# EAGLE design SwirlsV1.2 (EAGLE 6.5.0)

## Sheet 1 of 3
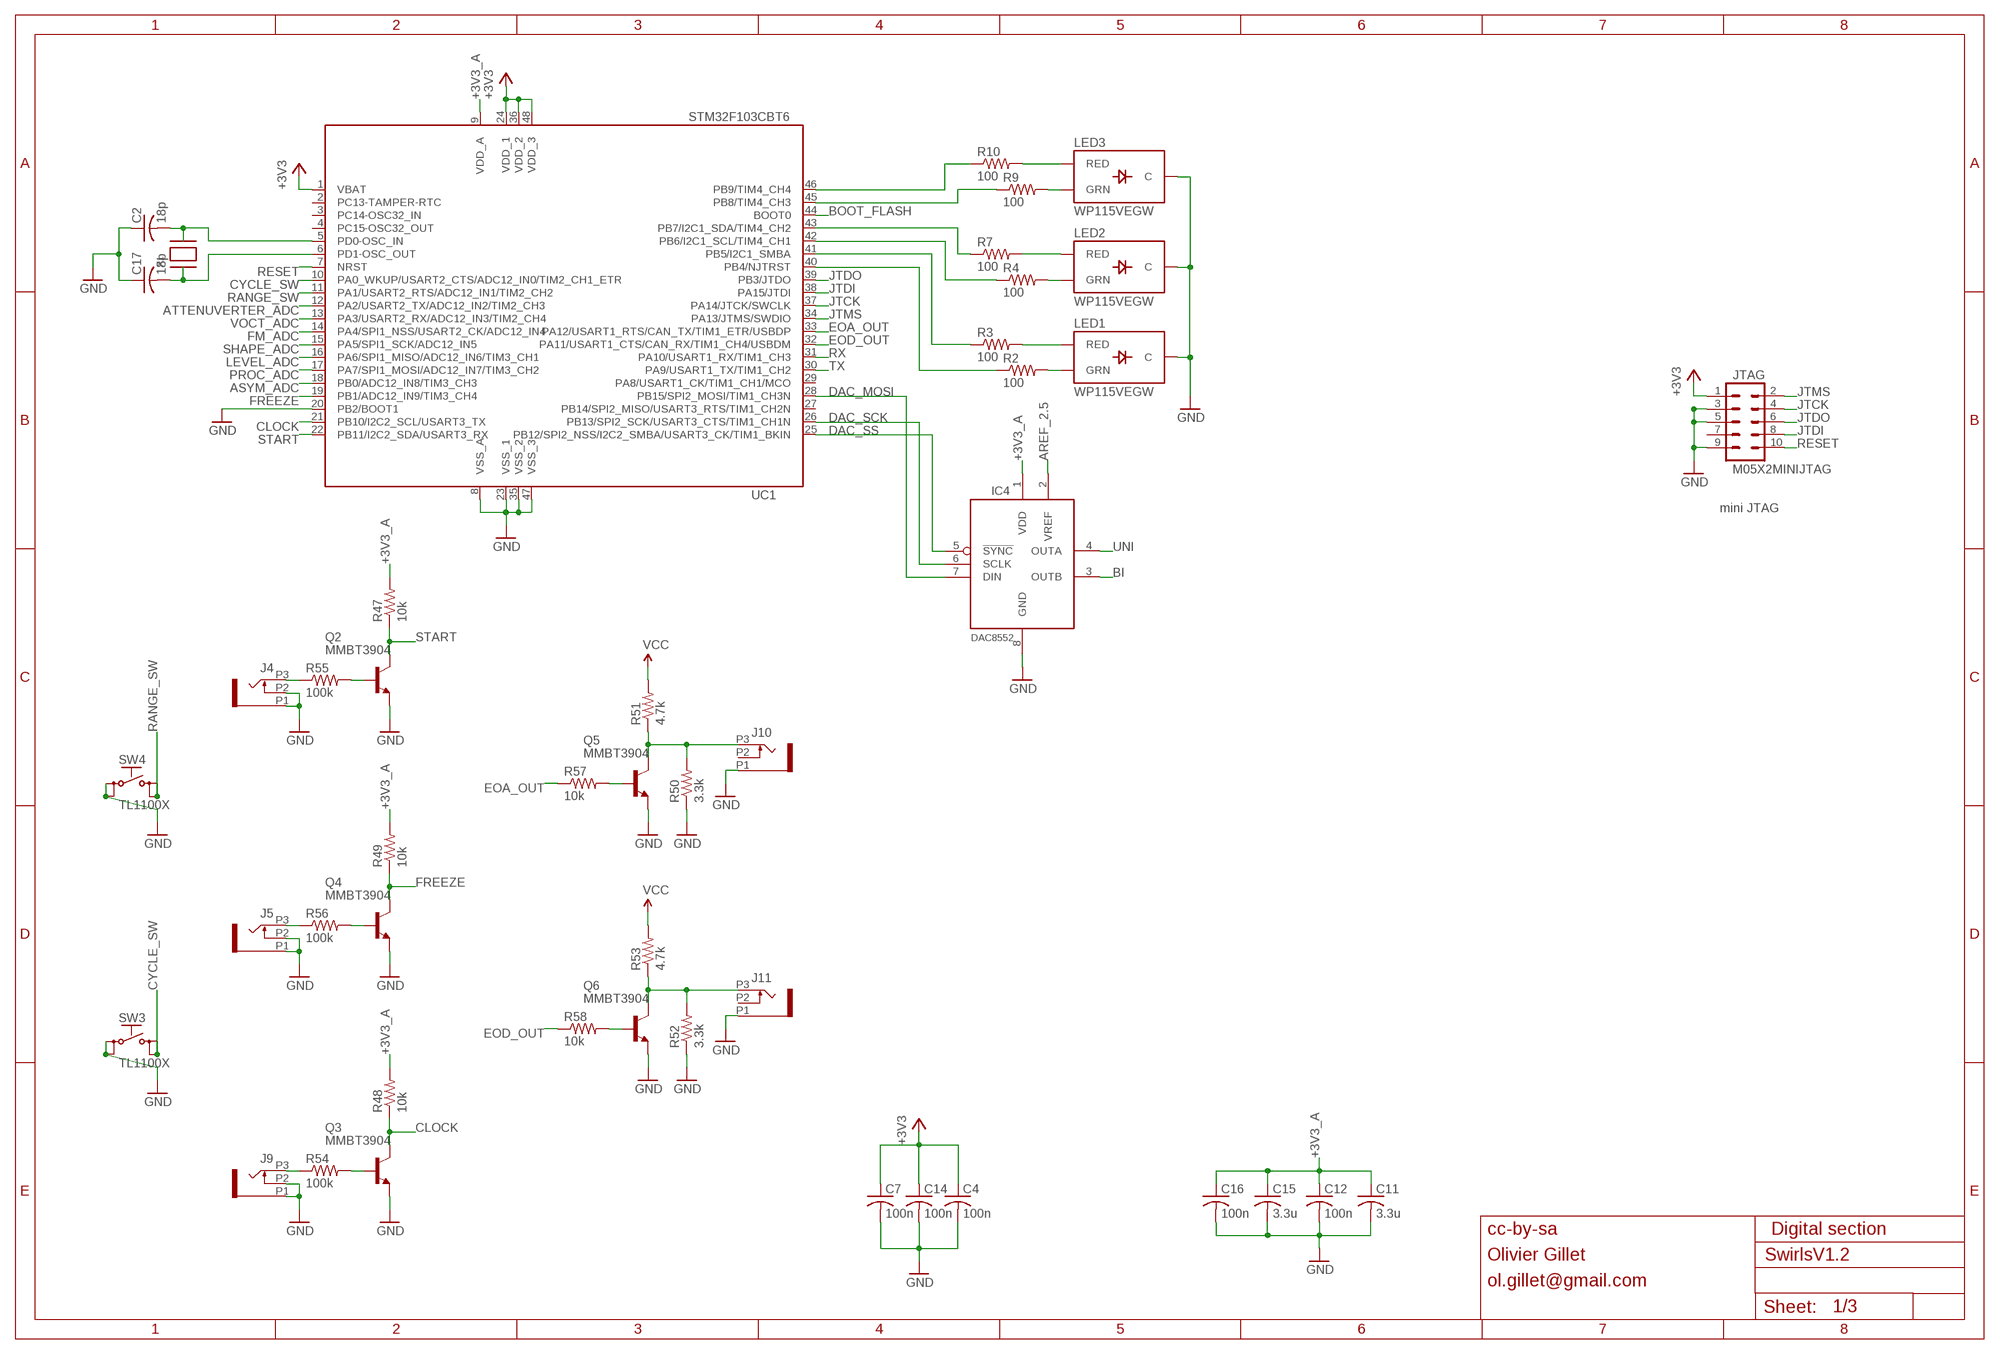
[diagram p0: schematic, sheet 1]

### Parts
C2  18p  C-USC0603  [C0603]
C4  100n  C-USC0603  [C0603]
C7  100n  C-USC0603  [C0603]
C11  3.3u  C-USC0603  [C0603]
C12  100n  C-USC0603  [C0603]
C14  100n  C-USC0603  [C0603]
C15  3.3u  C-USC0603  [C0603]
C16  100n  C-USC0603  [C0603]
C17  18p  C-USC0603  [C0603]
IC4  DAC8552  [MSOP-8]
J4  PJ301_GUI6  [OG-PJ301_VARIATIONS_WQP_PJ_301M6]
J5  PJ301_GUI6  [OG-PJ301_VARIATIONS_WQP_PJ_301M6]
J9  PJ301_GUI6  [OG-PJ301_VARIATIONS_WQP_PJ_301M6]
J10  PJ301_GUI6  [OG-PJ301_VARIATIONS_WQP_PJ_301M6]
J11  PJ301_GUI6  [OG-PJ301_VARIATIONS_WQP_PJ_301M6]
JTAG  M05X2MINIJTAG  [2X5-1.27]
LED1  WP115VEGW  LED-BICOLOR-THROUGHHOLE  [LED-BICOLOR-THROUGHHOLE]
LED2  WP115VEGW  LED-BICOLOR-THROUGHHOLE  [LED-BICOLOR-THROUGHHOLE]
LED3  WP115VEGW  LED-BICOLOR-THROUGHHOLE  [LED-BICOLOR-THROUGHHOLE]
Q2  MMBT3904  MMBT3904LT1-NPN-SOT23-BEC  [SOT23-BEC]
Q3  MMBT3904  MMBT3904LT1-NPN-SOT23-BEC  [SOT23-BEC]
Q4  MMBT3904  MMBT3904LT1-NPN-SOT23-BEC  [SOT23-BEC]
Q5  MMBT3904  MMBT3904LT1-NPN-SOT23-BEC  [SOT23-BEC]
Q6  MMBT3904  MMBT3904LT1-NPN-SOT23-BEC  [SOT23-BEC]
R2  100  R-US_R0603  [R0603]
R3  100  R-US_R0603  [R0603]
R4  100  R-US_R0603  [R0603]
R7  100  R-US_R0603  [R0603]
R9  100  R-US_R0603  [R0603]
R10  100  R-US_R0603  [R0603]
R47  10k  R-US_R0603  [R0603]
R48  10k  R-US_R0603  [R0603]
R49  10k  R-US_R0603  [R0603]
R50  3.3k  R-US_R0603  [R0603]
R51  4.7k  R-US_R0603  [R0603]
R52  3.3k  R-US_R0603  [R0603]
R53  4.7k  R-US_R0603  [R0603]
R54  100k  R-US_R0603  [R0603]
R55  100k  R-US_R0603  [R0603]
R56  100k  R-US_R0603  [R0603]
R57  10k  R-US_R0603  [R0603]
R58  10k  R-US_R0603  [R0603]
SW3  TL1100X  [TL1100X]
SW4  TL1100X  [TL1100X]
UC1  STM32F103CBT6  STM32F103CB  [LQFP48]
X1  XTALNX5032  [NX5032]

### Nets
+3V3: C4.1 C7.1 C14.1 JTAG.1 UC1.1(VBAT) UC1.24(VDD_1) UC1.36(VDD_2) UC1.48(VDD_3) ; also sheet 3
+3V3_A: C11.1 C12.1 C15.1 C16.1 IC4.1(VDD) R47.2 R48.2 R49.2 UC1.9(VDD_A) ; also sheet 2,3
AREF_2.5: IC4.2(VREF) ; also sheet 3
ASYM_ADC: UC1.18(PB0/ADC12_IN8/TIM3_CH3) ; also sheet 2
ATTENUVERTER_ADC: UC1.12(PA2/USART2_TX/ADC12_IN2/TIM2_CH3) ; also sheet 2
BI: IC4.3(OUTB) ; also sheet 2
BOOT_FLASH: UC1.44(BOOT0)
CLOCK: Q3.C R48.1 UC1.21(PB10/I2C2_SCL/USART3_TX)
CYCLE_SW: SW3.3(S) SW3.4(S1) UC1.10(PA0_WKUP/USART2_CTS/ADC12_IN0/TIM2_CH1_ETR)
DAC_MOSI: IC4.7(DIN) UC1.28(PB15/SPI2_MOSI/TIM1_CH3N)
DAC_SCK: IC4.6(SCLK) UC1.26(PB13/SPI2_SCK/USART3_CTS/TIM1_CH1N)
DAC_SS: IC4.5(!SYNC) UC1.25(PB12/SPI2_NSS/I2C2_SMBA/USART3_CK/TIM1_BKIN)
EOA_OUT: R57.1 UC1.33(PA12/USART1_RTS/CAN_TX/TIM1_ETR/USBDP)
EOD_OUT: R58.1 UC1.32(PA11/USART1_CTS/CAN_RX/TIM1_CH4/USBDM)
FM_ADC: UC1.14(PA4/SPI1_NSS/USART2_CK/ADC12_IN4) ; also sheet 2
FREEZE: Q4.C R49.1 UC1.19(PB1/ADC12_IN9/TIM3_CH4)
GND: C2.1 C4.2 C7.2 C11.2 C12.2 C14.2 C15.2 C16.2 C17.1 IC4.8(GND) J4.P1 J4.P2 J5.P1 J5.P2 J9.P1 J9.P2 J10.P1 J11.P1 JTAG.3 JTAG.5 JTAG.9 LED1.2(C) LED2.2(C) LED3.2(C) Q2.E Q3.E Q4.E Q5.E Q6.E R50.1 R52.1 SW3.1(P) SW3.2(P1) SW4.1(P) SW4.2(P1) UC1.8(VSS_A) UC1.20(PB2/BOOT1) UC1.23(VSS_1) UC1.35(VSS_2) UC1.47(VSS_3) ; also sheet 2,3
JTCK: JTAG.4 UC1.37(PA14/JTCK/SWCLK)
JTDI: JTAG.8 UC1.38(PA15/JTDI)
JTDO: JTAG.6 UC1.39(PB3/JTDO)
JTMS: JTAG.2 UC1.34(PA13/JTMS/SWDIO)
LEVEL_ADC: UC1.16(PA6/SPI1_MISO/ADC12_IN6/TIM3_CH1) ; also sheet 2
N$7: C2.2 UC1.5(PD0-OSC_IN) X1.P$2
N$8: C17.2 UC1.6(PD1-OSC_OUT) X1.P$1
N$21: J5.P3 R56.1
N$23: Q4.B R56.2
N$24: J9.P3 R54.1
N$25: Q3.B R54.2
N$26: Q6.B R58.2
N$27: J11.P3 Q6.C R52.2 R53.1
N$28: LED3.3(RED) R10.2
N$29: LED3.1(GRN) R9.2
N$30: LED2.3(RED) R7.2
N$31: LED2.1(GRN) R4.2
N$32: LED1.3(RED) R3.2
N$33: LED1.1(GRN) R2.2
N$34: R10.1 UC1.46(PB9/TIM4_CH4)
N$35: R9.1 UC1.45(PB8/TIM4_CH3)
N$36: R7.1 UC1.43(PB7/I2C1_SDA/TIM4_CH2)
N$37: R4.1 UC1.42(PB6/I2C1_SCL/TIM4_CH1)
N$38: R3.1 UC1.41(PB5/I2C1_SMBA)
N$39: R2.1 UC1.40(PB4/NJTRST)
N$44: J10.P3 Q5.C R50.2 R51.1
N$47: Q5.B R57.2
N$57: J4.P3 R55.1
N$66: Q2.B R55.2
PROC_ADC: UC1.17(PA7/SPI1_MOSI/ADC12_IN7/TIM3_CH2) ; also sheet 2
RANGE_SW: SW4.3(S) SW4.4(S1) UC1.11(PA1/USART2_RTS/ADC12_IN1/TIM2_CH2)
RESET: JTAG.10 UC1.7(NRST)
RX: UC1.31(PA10/USART1_RX/TIM1_CH3)
SHAPE_ADC: UC1.15(PA5/SPI1_SCK/ADC12_IN5) ; also sheet 2
START: Q2.C R47.1 UC1.22(PB11/I2C2_SDA/USART3_RX)
TX: UC1.30(PA9/USART1_TX/TIM1_CH2)
UNI: IC4.4(OUTA) ; also sheet 2
VCC: R51.2 R53.2 ; also sheet 2,3
VOCT_ADC: UC1.13(PA3/USART2_RX/ADC12_IN3/TIM2_CH4) ; also sheet 2
Unconnected: J10.P2 J11.P2 JTAG.7 UC1.2(PC13-TAMPER-RTC) UC1.3(PC14-OSC32_IN) UC1.4(PC15-OSC32_OUT) UC1.27(PB14/SPI2_MISO/USART3_RTS/TIM1_CH2N) UC1.29(PA8/USART1_CK/TIM1_CH1/MCO)

### Notes on the sheet
- mini JTAG
- cc-by-sa | Digital section
- Olivier Gillet
- ol.gillet@gmail.com

## Sheet 2 of 3
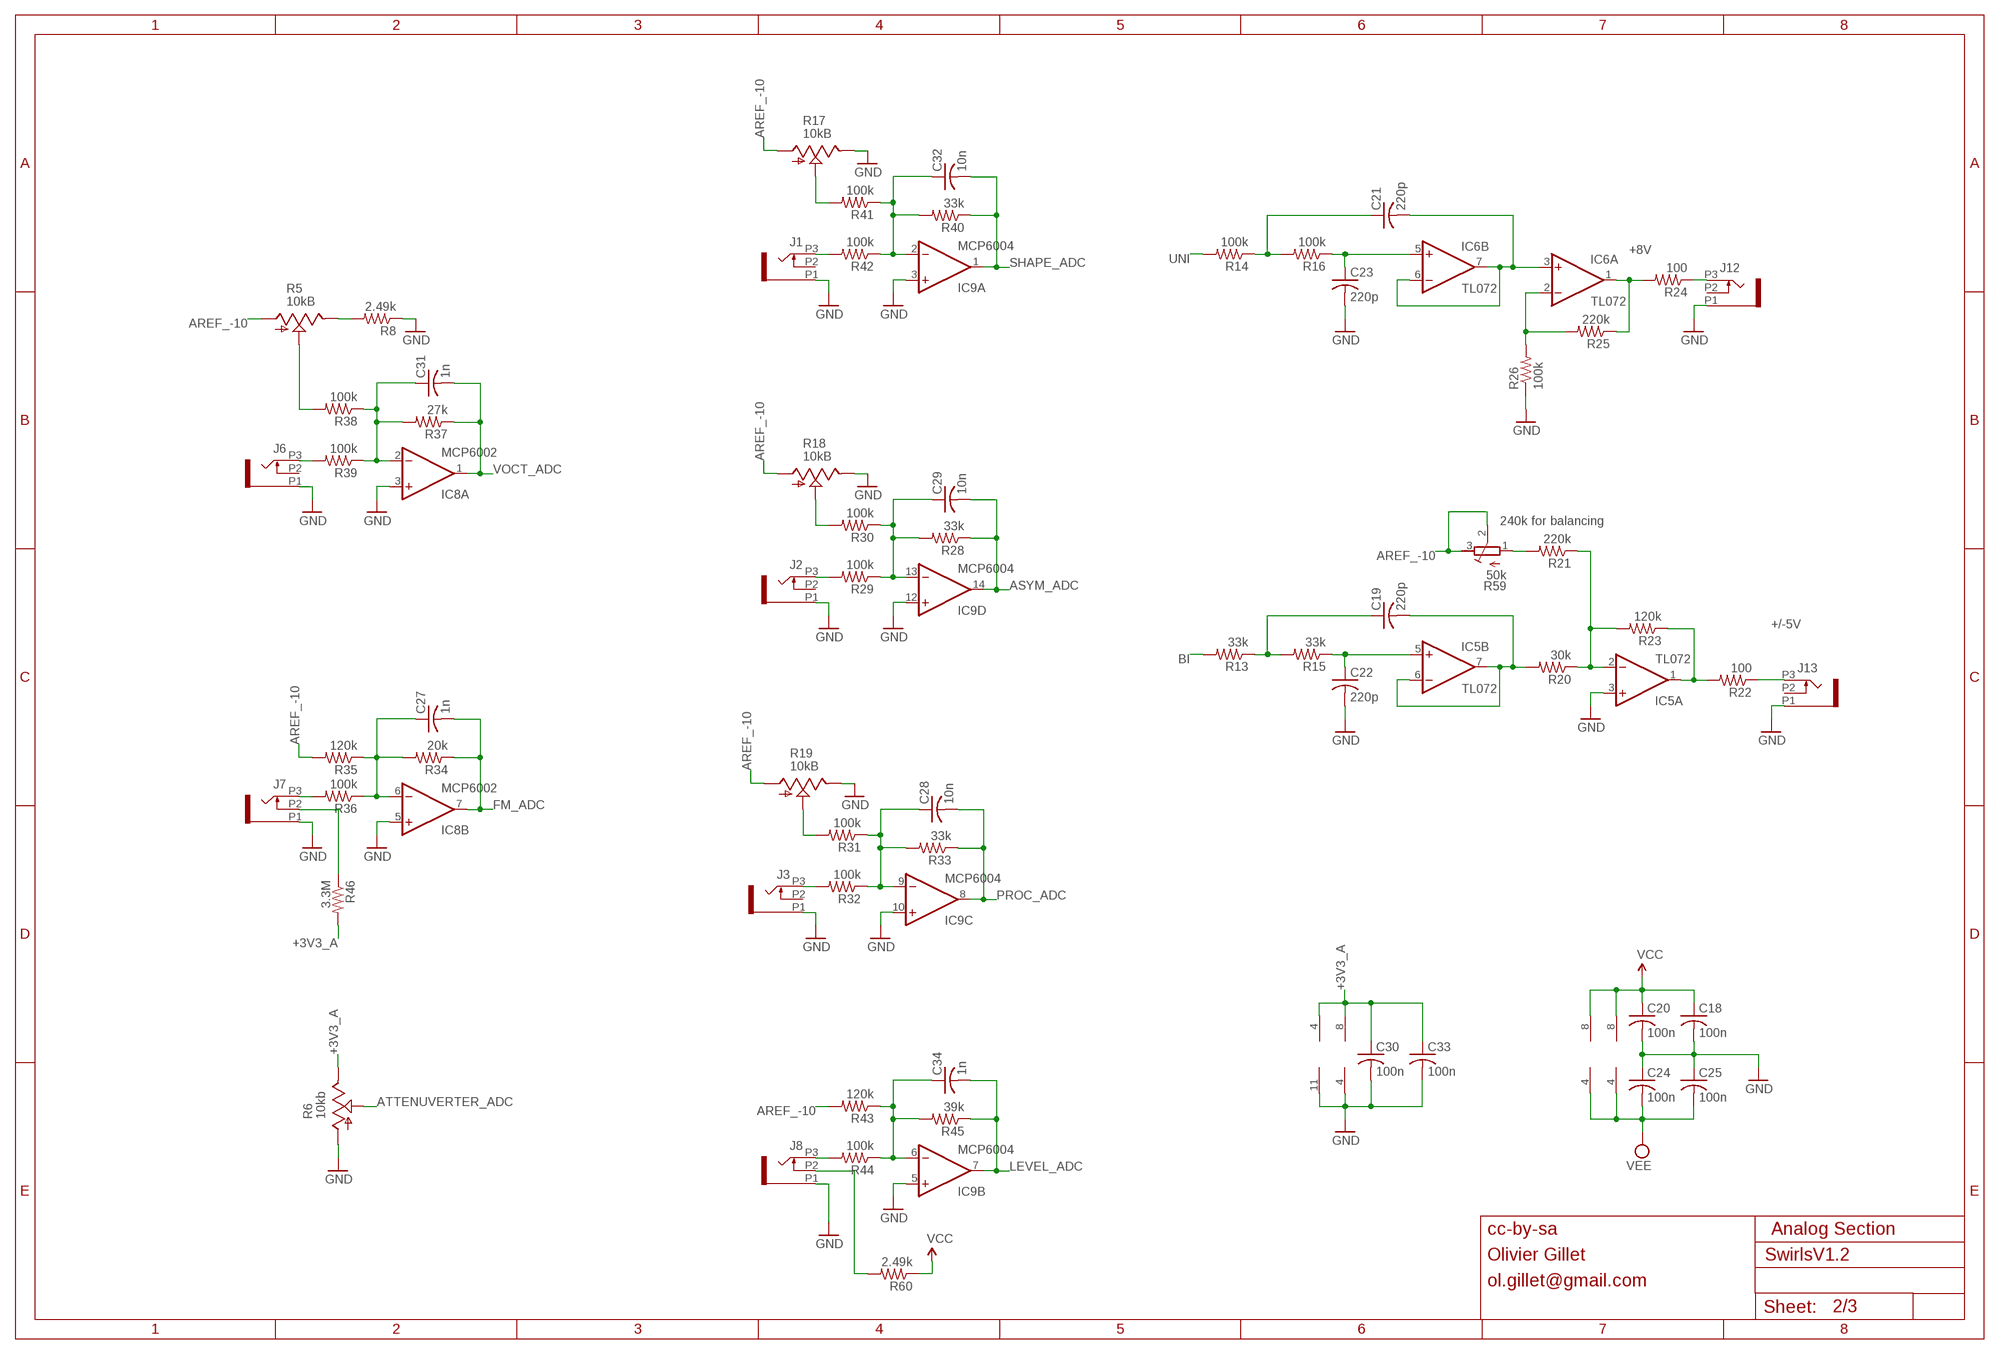
[diagram p1: schematic, sheet 2]

### Parts
C18  100n  C-USC0603  [C0603]
C19  220p  C-USC0603  [C0603]
C20  100n  C-USC0603  [C0603]
C21  220p  C-USC0603  [C0603]
C22  220p  C-USC0603  [C0603]
C23  220p  C-USC0603  [C0603]
C24  100n  C-USC0603  [C0603]
C25  100n  C-USC0603  [C0603]
C27  1n  C-USC0603  [C0603]
C28  10n  C-USC0603  [C0603]
C29  10n  C-USC0603  [C0603]
C30  100n  C-USC0603  [C0603]
C31  1n  C-USC0603  [C0603]
C32  10n  C-USC0603  [C0603]
C33  100n  C-USC0603  [C0603]
C34  1n  C-USC0603  [C0603]
IC5  TL072  TL072TSSOP  [TSSOP-8]
IC6  TL072  TL072TSSOP  [TSSOP-8]
IC8  MCP6002  TL072D  [SO08]
IC9  MCP6004  MCP6004ST  [TSSOP14]
J1  PJ301_GUI6  [OG-PJ301_VARIATIONS_WQP_PJ_301M6]
J2  PJ301_GUI6  [OG-PJ301_VARIATIONS_WQP_PJ_301M6]
J3  PJ301_GUI6  [OG-PJ301_VARIATIONS_WQP_PJ_301M6]
J6  PJ301_GUI6  [OG-PJ301_VARIATIONS_WQP_PJ_301M6]
J7  PJ301_GUI6  [OG-PJ301_VARIATIONS_WQP_PJ_301M6]
J8  PJ301_GUI6  [OG-PJ301_VARIATIONS_WQP_PJ_301M6]
J12  PJ301_GUI6  [OG-PJ301_VARIATIONS_WQP_PJ_301M6]
J13  PJ301_GUI6  [OG-PJ301_VARIATIONS_WQP_PJ_301M6]
R5  10kB  POT_USVERTICAL_PS  [ALPS_POT_VERTICAL_PS]
R6  10kb  POT-ALPS_POT_US  [TALLTRIMMER]
R8  2.49k  R-US_R0603  [R0603]
R13  33k  R-US_R0603  [R0603]
R14  100k  R-US_R0603  [R0603]
R15  33k  R-US_R0603  [R0603]
R16  100k  R-US_R0603  [R0603]
R17  10kB  POT-ALPS_POT_US  [TALLTRIMMER]
R18  10kB  POT-ALPS_POT_US  [TALLTRIMMER]
R19  10kB  POT-ALPS_POT_US  [TALLTRIMMER]
R20  30k  R-US_R0603  [R0603]
R21  220k  R-US_R0603  [R0603]
R22  100  R-US_R0603  [R0603]
R23  120k  R-US_R0603  [R0603]
R24  100  R-US_R0603  [R0603]
R25  220k  R-US_R0603  [R0603]
R26  100k  R-US_R0603  [R0603]
R28  33k  R-US_R0603  [R0603]
R29  100k  R-US_R0603  [R0603]
R30  100k  R-US_R0603  [R0603]
R31  100k  R-US_R0603  [R0603]
R32  100k  R-US_R0603  [R0603]
R33  33k  R-US_R0603  [R0603]
R34  20k  R-US_R0603  [R0603]
R35  120k  R-US_R0603  [R0603]
R36  100k  R-US_R0603  [R0603]
R37  27k  R-US_R0603  [R0603]
R38  100k  R-US_R0603  [R0603]
R39  100k  R-US_R0603  [R0603]
R40  33k  R-US_R0603  [R0603]
R41  100k  R-US_R0603  [R0603]
R42  100k  R-US_R0603  [R0603]
R43  120k  R-US_R0603  [R0603]
R44  100k  R-US_R0603  [R0603]
R45  39k  R-US_R0603  [R0603]
R46  3.3M  R-US_R0603  [R0603]
R59  50k  R-TRIMM3296W  [RTRIM3296W]
R60  2.49k  R-US_R0805  [R0805]

### Nets
+3V3_A: C30.1 C33.1 IC8.8(P:V+) IC9.4(P:V+) R6.P$1(E) R46.2 ; also sheet 1,3
AREF_-10: R5.P$3(A) R17.P$3(A) R18.P$3(A) R19.P$3(A) R35.2 R43.2 R59.2(S) R59.3(E) ; also sheet 3
ASYM_ADC: C29.2 IC9.14(D:OUT) R28.1 ; also sheet 1
ATTENUVERTER_ADC: R6.P$2(S) ; also sheet 1
BI: R13.2 ; also sheet 1
BI_OUT: IC5.1(A:OUT) R22.2 R23.1
F_CV: IC5.2(A:-IN) R20.1 R21.1 R23.2
FM_ADC: C27.2 IC8.7(B:OUT) R34.1 ; also sheet 1
GND: C18.2 C20.2 C22.2 C23.2 C24.1 C25.1 C30.2 C33.2 IC5.3(A:+IN) IC8.3(A:+IN) IC8.4(P:V-) IC8.5(B:+IN) IC9.3(A:+IN) IC9.5(B:+IN) IC9.10(C:+IN) IC9.11(P:V-) IC9.12(D:+IN) J1.P1 J2.P1 J3.P1 J6.P1 J7.P1 J8.P1 J12.P1 J13.P1 R6.P$3(A) R8.1 R17.P$1(E) R18.P$1(E) R19.P$1(E) R26.1 ; also sheet 1,3
LEVEL_ADC: C34.2 IC9.7(B:OUT) R45.1 ; also sheet 1
N$1: J1.P3 R42.2
N$2: C32.1 IC9.2(A:-IN) R40.2 R41.1 R42.1
N$3: R17.P$2(S) R41.2
N$4: J2.P3 R29.2
N$5: C29.1 IC9.13(D:-IN) R28.2 R29.1 R30.1
N$6: J7.P2 R46.1
N$9: R18.P$2(S) R30.2
N$10: J3.P3 R32.2
N$11: C28.1 IC9.9(C:-IN) R31.1 R32.1 R33.2
N$12: R19.P$2(S) R31.2
N$13: J8.P3 R44.2
N$14: C34.1 IC9.6(B:-IN) R43.1 R44.1 R45.2
N$15: J6.P3 R39.2
N$16: C31.1 IC8.2(A:-IN) R37.2 R38.1 R39.1
N$17: R5.P$2(S) R38.2
N$18: J13.P3 R22.1
N$19: R5.P$1(E) R8.2
N$20: J7.P3 R36.2
N$22: C27.1 IC8.6(B:-IN) R34.2 R35.1 R36.1
N$40: R21.2 R59.1(A)
N$41: IC6.2(A:-IN) R25.2 R26.2
N$42: C19.2 IC5.6(B:-IN) IC5.7(B:OUT) R20.2
N$43: C22.1 IC5.5(B:+IN) R15.1
N$45: C19.1 R13.1 R15.2
N$46: IC6.1(A:OUT) R24.2 R25.1
N$48: J8.P2 R60.2
N$67: C21.2 IC6.3(A:+IN) IC6.6(B:-IN) IC6.7(B:OUT)
N$69: C23.1 IC6.5(B:+IN) R16.1
N$71: C21.1 R14.1 R16.2
PROC_ADC: C28.2 IC9.8(C:OUT) R33.1 ; also sheet 1
SHAPE_ADC: C32.2 IC9.1(A:OUT) R40.1 ; also sheet 1
UNI: R14.2 ; also sheet 1
UNI_OUT: J12.P3 R24.1
VCC: C18.1 C20.1 IC5.8(P:V+) IC6.8(P:V+) R60.1 ; also sheet 1,3
VEE: C24.2 C25.2 IC5.4(P:V-) IC6.4(P:V-) ; also sheet 3
VOCT_ADC: C31.2 IC8.1(A:OUT) R37.1 ; also sheet 1
Unconnected: J1.P2 J2.P2 J3.P2 J6.P2 J12.P2 J13.P2

### Notes on the sheet
- +8V
- 240k for balancing
- +/-5V
- cc-by-sa | Analog Section
- Olivier Gillet
- ol.gillet@gmail.com

## Sheet 3 of 3
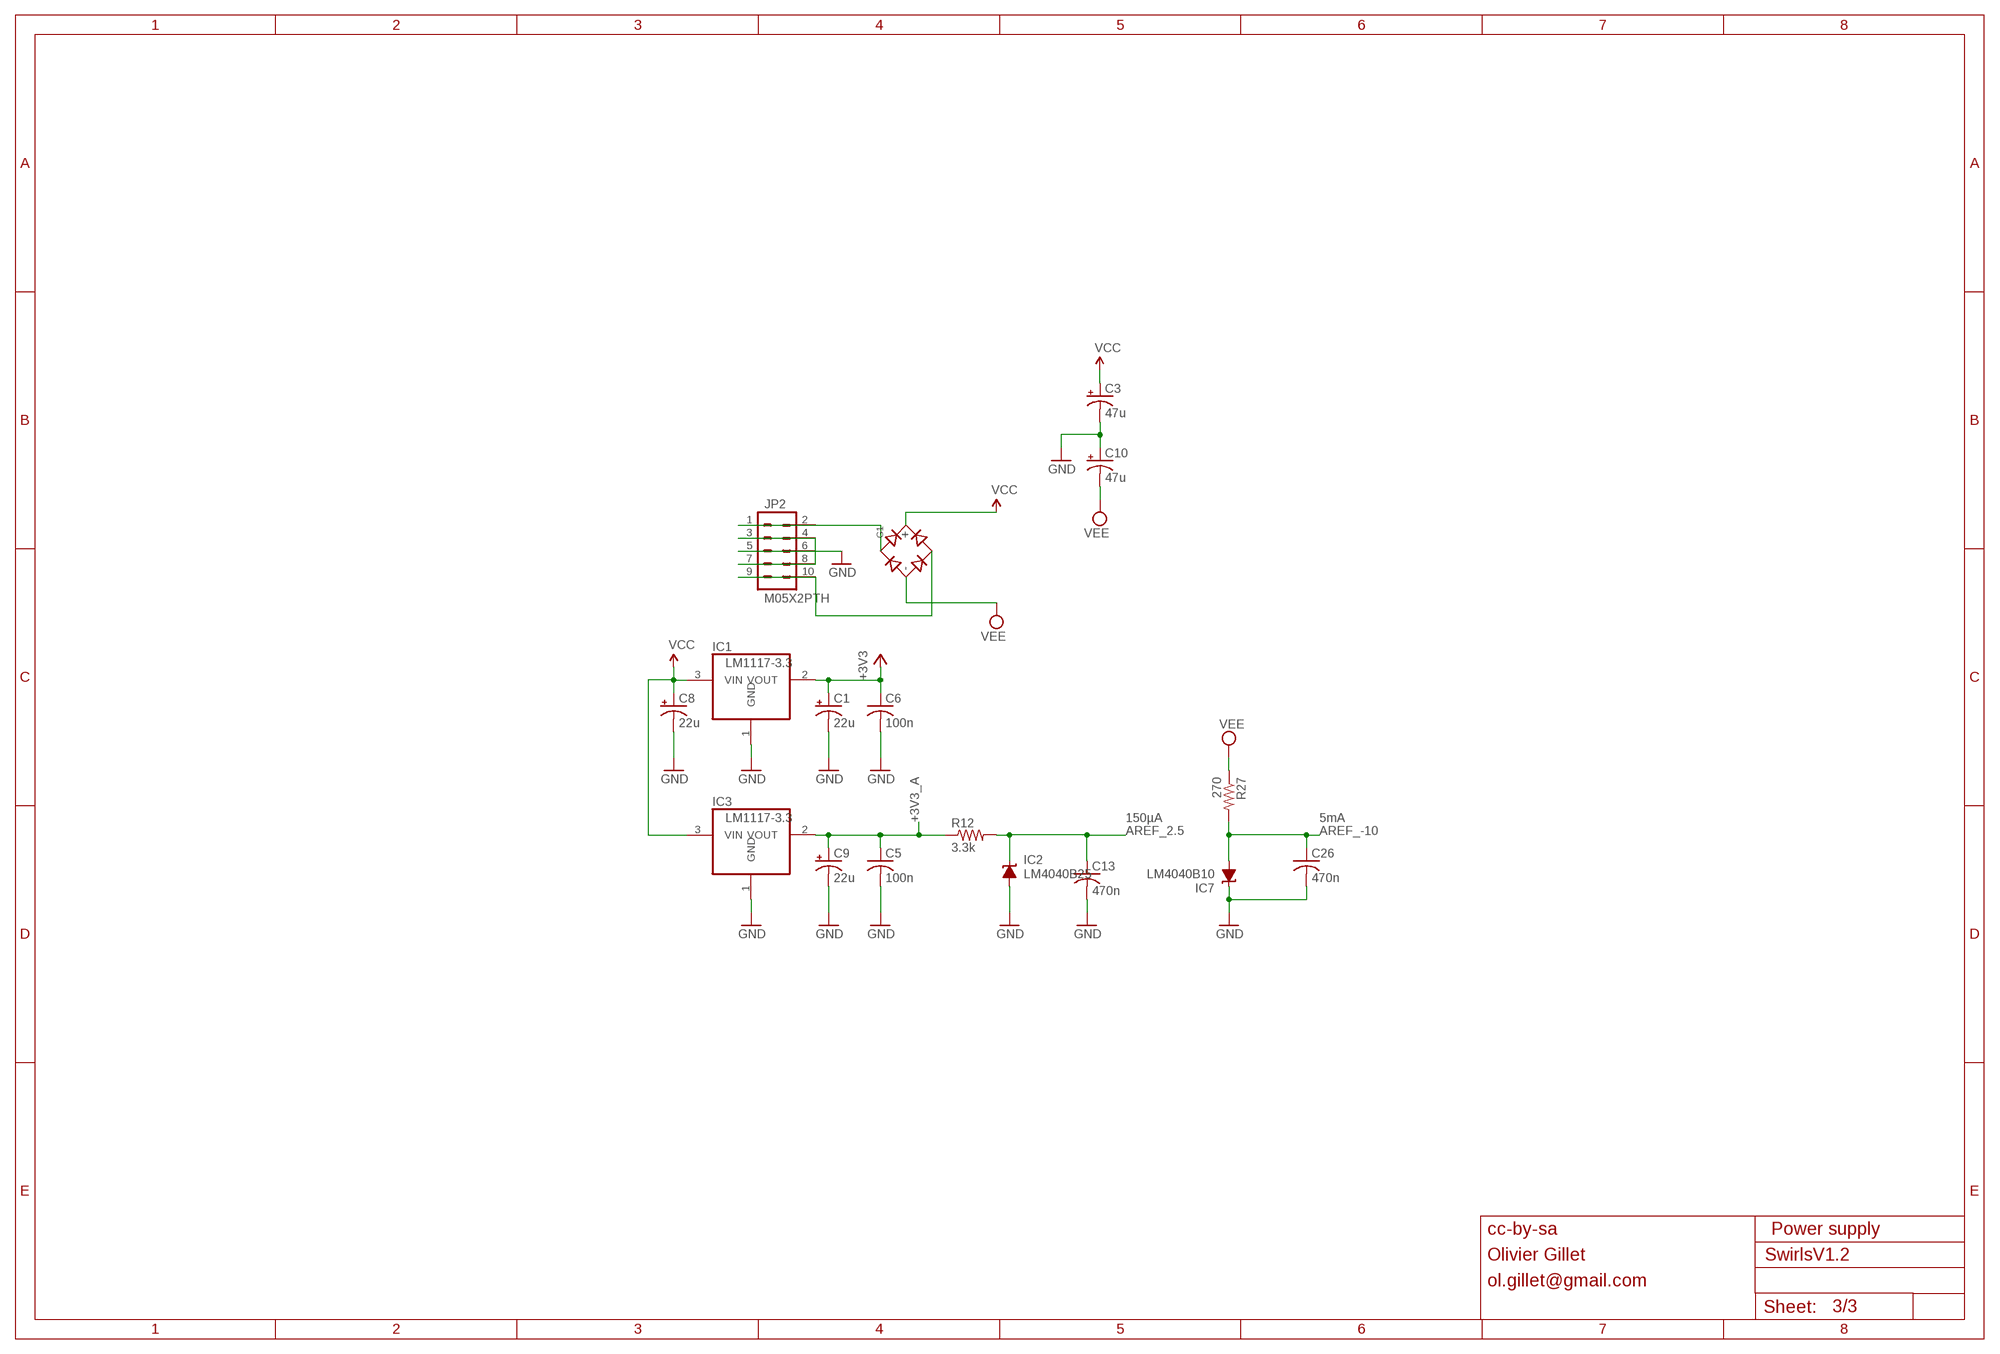
[diagram p2: schematic, sheet 3]

### Parts
C1  22u  CPOL-USC  [PANASONIC_C]
C3  47u  CPOL-USC  [PANASONIC_C]
C5  100n  C-USC0603  [C0603]
C6  100n  C-USC0603  [C0603]
C8  22u  CPOL-USC  [PANASONIC_C]
C9  22u  CPOL-USC  [PANASONIC_C]
C10  47u  CPOL-USC  [PANASONIC_C]
C13  470n  C-USC0603  [C0603]
C26  470n  C-USC0603  [C0603]
G1  BRIDGERECTIFIER  [SOIC-4]
IC1  LM1117-3.3  REG1117  [SOT223]
IC2  LM4040B25  LM4041B12DBZ  [DBZ_R-PDSO-G3]
IC3  LM1117-3.3  REG1117  [SOT223]
IC7  LM4040B10  LM4041B12DBZ  [DBZ_R-PDSO-G3]
JP2  M05X2PTH  [AVR_ICSP]
R12  3.3k  R-US_R0603  [R0603]
R27  270  R-US_R0603  [R0603]

### Nets
+3V3: C1.+ C6.1 IC1.2(VOUT) ; also sheet 1
+3V3_A: C5.1 C9.+ IC3.2(VOUT) R12.1 ; also sheet 1,2
AREF_2.5: C13.1 IC2.1(C) R12.2 ; also sheet 1
AREF_-10: C26.1 IC7.2(A) R27.2 ; also sheet 2
GND: C1.- C3.- C5.2 C6.2 C8.- C9.- C10.+ C13.2 C26.2 IC1.1(GND) IC2.2(A) IC3.1(GND) IC7.1(C) JP2.3 JP2.4 JP2.5 JP2.6 JP2.7 JP2.8 ; also sheet 1,2
N$49: G1.~1(AC1) JP2.1 JP2.2
N$50: G1.~2(AC2) JP2.9 JP2.10
VCC: C3.+ C8.+ G1.+ IC1.3(VIN) IC3.3(VIN) ; also sheet 1,2
VEE: C10.- G1.- R27.1 ; also sheet 2

### Notes on the sheet
- 150µA | 5mA
- cc-by-sa | Power supply
- Olivier Gillet
- ol.gillet@gmail.com

## Library data of the parts
C1 C3 C8-C10 = rcl:CPOL-US: POLARIZED CAPACITOR, American symbol
C2 C4-C7 C11-C34 = rcl:C-US: CAPACITOR, American symbol
G1 = microbuilder:BRIDGERECTIFIER: Bridge Rectifier SOIC-4: Comchip B4S-G - 400V 800mA, Peak Vf 1.1V (Digikey: 641-1334-1-ND)
IC1 IC3 = og-vreg:REG1117: 800mA and 1A Low Dropout (LDO) Positive Regulator 1.8V, 2.5V, 2.85V, 3.3V, 5V, and Adj
IC2 IC7 = texas:LM4041: PRECISION MICROPOWER SHUNT VOLTAGE REFERENCE Source: http://focus.ti.com/lit/ds/slcs146e/slcs146e.pdf
IC4 = og-dac:DAC8552
IC5 IC6 = MusicThingModular:TL072: Generic Dual Op Amp
IC8 = linear:TL072: OP AMP
IC9 = linear:MCP6004: Quad Op Amp
J1-J13 = MILibuTides5:PJ301_GUI
JP2 = braids_v50:M05X2: Header 5x2 Standard 10-pin dual row 0.1" header. Commonly used with AVR-ISP. Use with Spark Fun Electronics SKU: PRT-00778
JTAG = og-header:M05X2: Header 5x2 Standard 10-pin dual row 0.1" header. Commonly used with AVR-ISP. Use with Spark Fun Electronics SKU: PRT-00778
LED1-LED3 = og-leds:LED-BICOLOR-THROUGHHOLE
Q2-Q6 = transistor:*-NPN-: NPN Transistror BF959 corrected 2008.03.06
R2-R4 R7-R10 R12-R16 R20-R58 R60 = rcl:R-US_: RESISTOR, American symbol
R5 = pot-alps:POT_US
R6 R17-R19 = MILibuTides5:POT-ALPS_POT_US
R59 = rcl:R-TRIMM: Trimm resistor
SW3 SW4 = switch-e-switch:TL1100X: TACTILE SWITCH
UC1 = stm32:STM32F103CB
X1 = Icotech_Eagle_Library:XTAL: Low cost SMT crystals, no capacitors included http://www.ladyada.net/library/eagle

## Board
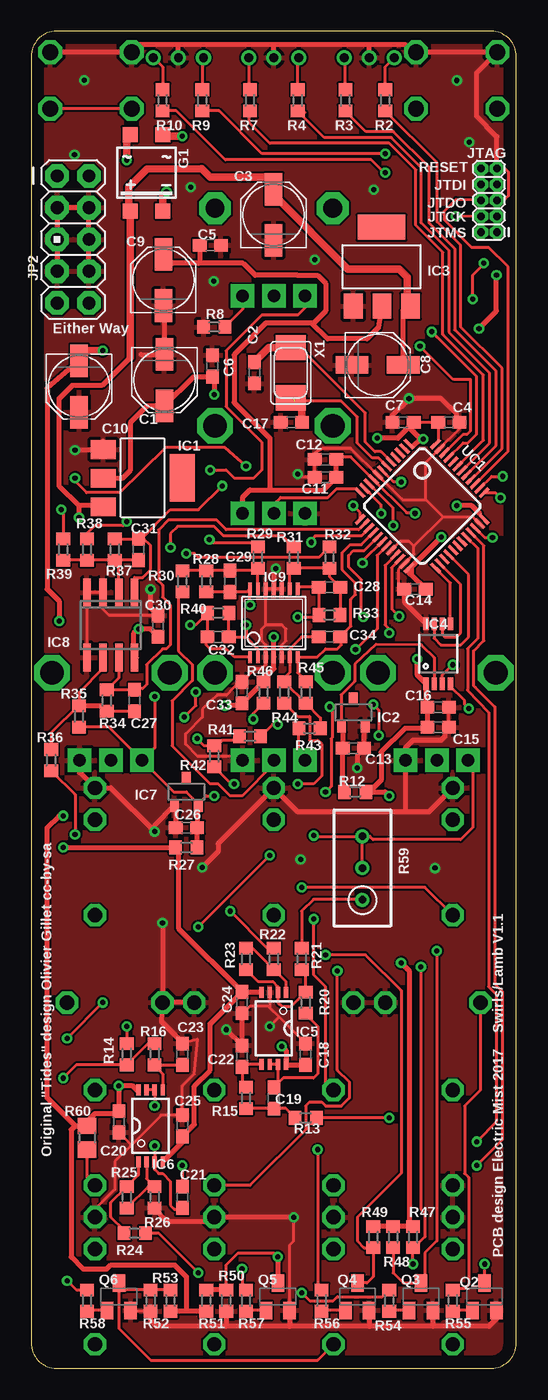
[diagram p3: board, top side]
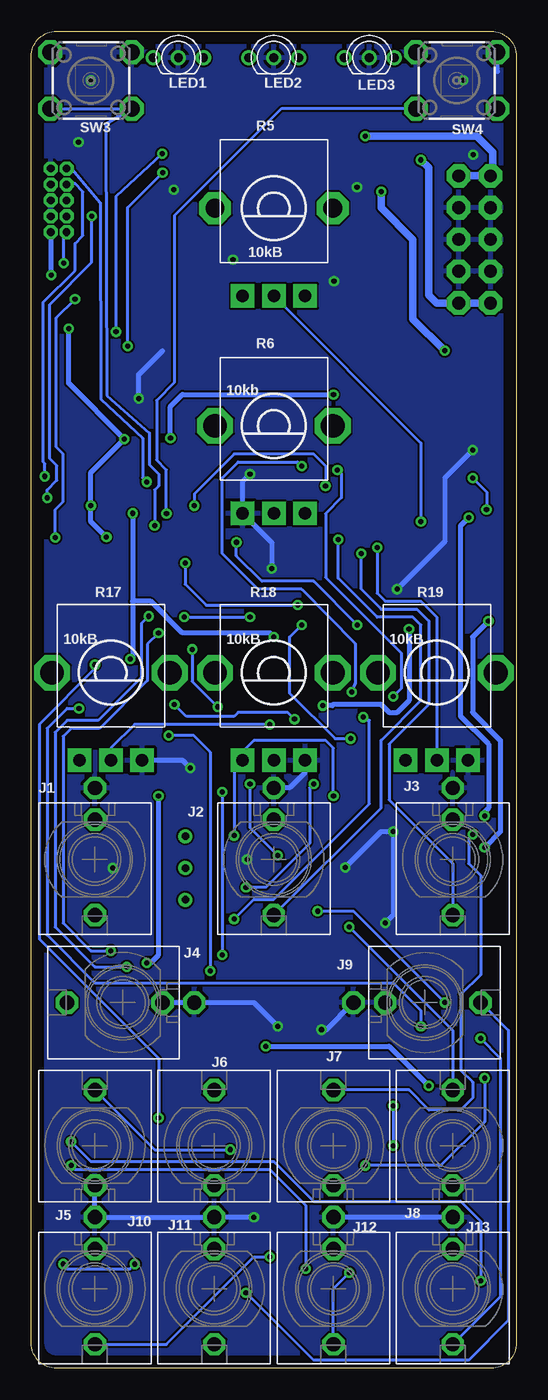
[diagram p4: board, bottom side, seen from below]

Size 38.73 x 106.8 mm. Coordinates in mm from the lower left corner, seen from the top.
Outline: 0,104.8 0,2 arc90 2,0 36.74,0 arc90 38.74,2 38.74,104.8 arc90 36.74,106.8 2,106.8 arc90 0,104.8
Copper layers (1*16): Top 0.035mm / dielectric 1.5mm / Bottom 0.035mm
Design rules "PCBway": minimum track width 6mil, minimum drill 0.2mm, track to track 0.15mm, track to pad 0.15mm, pad to pad 0.15mm, via to via 0.15mm, smd to smd 0.15mm, copper to edge 40mil, drill to drill 8mil, minimum pad ring 10mil, minimum via ring 8mil, stop-mask expansion 4mil, vias tented up to drill 25mil, thermal gap 10mil

### Footprints (pad centres in the part's own frame; a part is rotated, then mirrored left to right if it is on the bottom)
PANASONIC_C = smd 2.6 x 1.4: + 2.05,0; - -2.05,0
C0603 = smd 1.1 x 1: 1 -0.85,0; 2 0.85,0
SOIC-4 = smd 1.2 x 1.2: + 1.3,3.05; - -1.3,3.05; ~1 -1.3,-3.05; ~2 1.3,-3.05
SOT223 = smd 1.499 x 2.007: 1 -2.261,-3.15; 2 0.025,-3.15; 3 2.311,-3.15 | smd 3.81 x 2.007: 4 0,3.15
DBZ_R-PDSO-G3 = smd 0.7 x 1: 1 -0.95,-1.1; 2 0.95,-1.1; 3 0,1.1
MSOP-8 = smd 0.41 x 1.02: 1 -0.975,-2.4; 2 -0.325,-2.4; 3 0.325,-2.4; 4 0.975,-2.4; 5 0.975,2.4; 6 0.325,2.4; 7 -0.325,2.4; 8 -0.975,2.4
TSSOP-8 = smd 0.9 x 0.35: 1 -2.875,0.975; 2 -2.875,0.325; 3 -2.875,-0.325; 4 -2.875,-0.975; 5 2.875,-0.975; 6 2.875,-0.325; 7 2.875,0.325; 8 2.875,0.975
SO08 = smd 0.6 x 2.2: 1 -1.905,-2.6; 2 -0.635,-2.6; 3 0.635,-2.6; 4 1.905,-2.6; 5 1.905,2.6; 6 0.635,2.6; 7 -0.635,2.6; 8 -1.905,2.6
TSSOP14 = smd 0.305 x 0.991: 1 -1.905,-2.718; 2 -1.27,-2.718; 3 -0.635,-2.718; 4 0,-2.718; 5 0.635,-2.718; 6 1.27,-2.718; 7 1.905,-2.718; 8 1.905,2.718; 9 1.27,2.718; 10 0.635,2.718; 11 0,2.718; 12 -0.635,2.718; 13 -1.27,2.718; 14 -1.905,2.718
OG-PJ301_VARIATIONS_WQP_PJ_301M6 = drill 1.143 pad 1.778 octagon: P1 0,-5.715; P2 0,-3.175; P3 0,4.445
AVR_ICSP = drill 1.016 pad 1.88 octagon: 1 -1.27,5.08; 2 1.27,5.08; 3 -1.27,2.54; 4 1.27,2.54; 5 -1.27,0; 6 1.27,0; 7 -1.27,-2.54; 8 1.27,-2.54; 9 -1.27,-5.08; 10 1.27,-5.08
2X5-1.27 = drill 0.61 pad 1.067 octagon: 1 -1.27,3.81; 2 0,3.81; 3 -1.27,2.54; 4 0,2.54; 5 -1.27,1.27; 6 0,1.27; 7 -1.27,0; 8 0,0; 9 -1.27,-1.27; 10 0,-1.27
LED-BICOLOR-THROUGHHOLE = drill 0.7: 1 -2,0; 2 0,0; 3 2,0
SOT23-BEC = smd 1 x 1.4: B -0.95,-1.1; C 0,1.1; E 0.95,-1.1
R0603 = smd 1 x 1.1: 1 -0.85,0; 2 0.85,0
ALPS_POT_VERTICAL_PS = drill 1 pad 1.88 square: P$1 -2.5,7; P$2 0,7; P$3 2.5,7 | drill 1.5 pad 2.54 octagon: P$4 -4.7,0; P$5 4.7,0
TALLTRIMMER = drill 1 pad 1.88 square: P$1 -2.5,7; P$2 0,7; P$3 2.5,7 | drill 1.9 pad 2.1 octagon: P$4 -4.7,0; P$5 4.7,0
RTRIM3296W = drill 0.61: 1 0,-2.54; 2 0,0; 3 0,2.54
R0805 = smd 1.3 x 1.5: 1 -0.95,0; 2 0.95,0
TL1100X = drill 1.27 octagon: 1 -3.251,-2.261; 2 3.251,-2.261; 3 -3.251,2.261; 4 3.251,2.261
LQFP48 = smd 0.254 x 1: 1 -2.75,-4.25; 2 -2.25,-4.25; 3 -1.75,-4.25; 4 -1.25,-4.25; 5 -0.75,-4.25; 6 -0.25,-4.25; 7 0.25,-4.25; 8 0.75,-4.25; 9 1.25,-4.25; 10 1.75,-4.25; 11 2.25,-4.25; 12 2.75,-4.25; 25 2.75,4.25; 26 2.25,4.25; 27 1.75,4.25; 28 1.25,4.25; 29 0.75,4.25; 30 0.25,4.25; 31 -0.25,4.25; 32 -0.75,4.25; 33 -1.25,4.25; 34 -1.75,4.25; 35 -2.25,4.25; 36 -2.75,4.25 | smd 1 x 0.254: 13 4.25,-2.75; 14 4.25,-2.25; 15 4.25,-1.75; 16 4.25,-1.25; 17 4.25,-0.75; 18 4.25,-0.25; 19 4.25,0.25; 20 4.25,0.75; 21 4.25,1.25; 22 4.25,1.75; 23 4.25,2.25; 24 4.25,2.75; 37 -4.25,2.75; 38 -4.25,2.25; 39 -4.25,1.75; 40 -4.25,1.25; 41 -4.25,0.75; 42 -4.25,0.25; 43 -4.25,-0.25; 44 -4.25,-0.75; 45 -4.25,-1.25; 46 -4.25,-1.75; 47 -4.25,-2.25; 48 -4.25,-2.75
NX5032 = smd 2 x 2.4: P$1 2,0; P$2 -2,0

### Placement (x,y rotation side)
C1  10.64,78.93 270 top
C2  17.82,79.52 90 top
C3  19.34,92.13 90 top
C4  33.34,75.56 0 top
C5  14.29,89.71 0 top
C6  14.46,80.06 90 top
C7  29.69,75.56 180 top
C8  27.65,80.15 0 top
C9  10.55,86.94 90 top
C10  3.81,78.42 270 top
C11  23.5,71.18 180 top
C12  23.5,72.59 180 top
C13  25.72,49.53 0 top
C14  30.64,62.23 180 top
C15  32.5,51.2 0 top
C16  32.5,52.78 0 top
C17  20.76,75.57 0 top
C18  21.91,25.08 90 top
C19  19.37,21.59 90 top
C20  6.99,19.69 270 top
C21  12.06,13.65 270 top
C22  16.83,24.93 90 top
C23  12.06,25.08 90 top
C24  16.83,29.21 90 top
C25  12.06,19.37 270 top
C26  12.38,43.18 180 top
C27  8.26,53.34 90 top
C28  23.81,62.39 180 top
C29  15.88,62.87 270 top
C30  10.12,59.28 90 top
C31  8.57,65.4 90 top
C32  14.92,58.42 180 top
C33  16.83,53.98 90 top
C34  23.81,58.42 0 top
G1  9.2,95.49 180 top
IC1  8.89,71.12 270 top
IC2  25.72,52.39 0 top
IC3  27.97,87.99 0 top
IC4  32.5,57.07 0 top
IC5  19.37,27.14 270 top
IC6  9.53,19.37 90 top
IC7  12.38,46.04 0 top
IC8  6.35,59.37 180 top
IC9  19.37,59.53 0 top
J1  33.66,40.64 180 bottom
J2  19.37,40.64 180 bottom
J3  5.08,40.64 180 bottom
J4  31.43,29.21 90 bottom
J5  33.66,17.78 0 bottom
J6  24.13,17.78 0 bottom
J7  14.61,17.78 0 bottom
J8  5.08,17.78 0 bottom
J9  7.3,29.21 270 bottom
J10  33.66,6.35 180 bottom
J11  24.13,6.35 180 bottom
J12  14.61,6.35 180 bottom
J13  5.08,6.35 180 bottom
JP2  3.33,90.17 0 top
JTAG  35.91,94.56 180 top
LED1  26.99,104.68 0 bottom
LED2  19.37,104.68 0 bottom
LED3  11.75,104.68 0 bottom
Q2  36.2,5.71 0 top
Q3  31.11,5.71 0 top
Q4  26.04,5.71 0 top
Q5  19.68,5.71 0 top
Q6  6.99,5.71 0 top
R2  28.26,101.28 90 top
R3  25.08,101.28 90 top
R4  21.27,101.28 90 top
R5  19.37,92.66 180 bottom
R6  19.37,75.28 180 bottom
R7  17.46,101.28 90 top
R8  14.61,83.18 0 top
R9  13.65,101.28 90 top
R10  10.48,101.28 90 top
R12  25.88,46.04 180 top
R13  21.91,20 0 top
R14  7.62,25.08 90 top
R15  17.14,21.59 270 top
R16  9.84,25.08 90 top
R17  32.38,55.56 180 bottom
R18  19.37,55.56 180 bottom
R19  6.35,55.56 180 bottom
R20  21.91,29.21 270 top
R21  21.59,32.7 90 top
R22  19.37,32.7 270 top
R23  17.14,32.7 270 top
R24  8.26,10.79 180 top
R25  7.62,13.65 270 top
R26  9.84,13.65 90 top
R27  12.38,41.59 0 top
R28  13.97,62.87 90 top
R29  18.1,64.77 90 top
R30  12.06,62.87 270 top
R31  20.96,64.77 90 top
R32  23.81,64.77 90 top
R33  23.81,60.16 0 top
R34  6.03,53.34 270 top
R35  3.81,52.07 270 top
R36  1.59,48.58 270 top
R37  6.67,65.4 270 top
R38  4.45,65.4 90 top
R39  2.54,65.4 90 top
R40  14.92,60.33 0 top
R41  17.46,50.48 0 top
R42  14.61,48.9 270 top
R43  22.23,51.12 180 top
R44  20.19,53.98 270 top
R45  21.91,53.98 270 top
R46  18.54,53.98 90 top
R47  30.48,10.48 90 top
R48  28.89,10.48 90 top
R49  27.3,10.48 90 top
R50  15.56,5.4 90 top
R51  13.97,5.4 270 top
R52  9.53,5.4 90 top
R53  11.11,5.4 270 top
R54  28.57,5.4 270 top
R55  33.66,5.4 270 top
R56  23.18,5.4 270 top
R57  17.14,5.4 270 top
R58  4.45,5.4 270 top
R59  26.43,39.96 0 top
R60  4.45,18.41 270 top
SW3  33.97,102.87 180 bottom
SW4  4.76,102.87 180 bottom
UC1  31.21,68.88 225 top
X1  20.72,79.52 270 top

### Tracks (layer width: path | path; a pad name or v marks a point on that pad's centre or on a via)
+3V3  (via drill 0.41, 0.41 pad 0.25)
  Top 0.254: 30.15,75.18 C7.1 C4.1 32.49,74.04 UC1.48 | 31.12,74.04 v31.31,74.23 | 30.15,63.57 UC1.24 | UC1.1 30.32,73.66 30.48,73.66 | UC1.36 35.78,68.2 35.78,68.29 35.78,68.33 | v33.97,68.9
  Top 0.406: v35.75,83.06 37.15,84.46 v37.15,87.31 | IC1.2 5.77,71.12 7.3,71.12 7.94,71.76 7.94,75.57 9.25,76.88 C1.+ 12.97,79.21 C6.1 14.61,79.07 v14.61,77.79 | v27.62,74.3 29.27,74.3 30.15,75.18 31.1,74.23 v31.31,74.23 31.05,74.23 30.48,73.66 | v33.97,68.9 35.18,68.9 35.78,68.29 | C14.1 30.35,63.37 | 30.35,63.37 30.15,63.57 | v32.73,66.39 30.35,64 30.35,63.37
  Bottom 0.254: 37.15,90.72 JTAG.1
  Bottom 0.406: v37.15,87.31 37.15,90.72 | v27.62,74.3 27.62,76.84 26.67,77.79 v14.61,77.79 | v32.73,66.39 33.97,67.63 v33.97,68.9 33.97,71.56 v31.31,74.23 35.75,78.68 v35.75,83.06
+3V3_A  (via drill 0.41, 0.41 pad 0.25)
  Top 0.254: 31.43,54.76 IC4.1 | IC8.8 8.46,56.77 | R46.2 | C33.1 16.73,53.02 | C12.1 24.36,72.8 25.53,72.8 UC1.9 29.97,68.35 30.64,68.35 v30.64,68.29
  Top 0.406: R6.P$1 16.87,69.57 17.46,70.17 19.05,70.17 | 19.05,70.17 23.33,70.17 C11.1 C12.1 | 13.34,88.27 16.91,88.27 17.87,87.32 21.27,87.31 22.86,87.31 23.5,86.68 23.5,84.46 22.54,83.5 22.37,83.5 | 13.34,88.27 11.27,88.27 C9.+ | IC4.1 31.52,52.91 C16.1 C15.1 31.57,51.12 29.85,51.12 27.94,49.21 27.94,46.99 26.99,46.04 | v19.37,58.42 IC9.4 19.37,55.88 18.54,55.05 R46.2 | 26.99,46.04 R12.1 | 31.43,54.76 30.83,55.36 v30.83,56.64 | 16.73,53.02 16.63,52.93 v15.46,52.93 | 22.37,83.5 18.73,83.5 16.19,80.96 16.19,77.15 19.05,74.3 19.05,70.17 | R46.2 C33.1 | C30.1 10.12,58.46 9.53,59.06 v8.57,59.06 8.54,59.06 8.16,58.67 8.16,56.87 IC8.8 | 26.99,46.04 28.26,46.04 v28.58,45.72 | R49.2 R48.2 R47.2 30.16,11.65 30.16,31.75 v29.53,32.39 | C5.1 13.44,88.37 13.34,88.27 | IC3.2 27.71,83.12 26.82,82.23 23.64,82.23 22.37,83.5
  Bottom 0.406: v8.57,59.06 8.57,53.34 9.53,52.39 10.16,52.39 10.8,53.02 14.61,53.02 14.7,52.93 v15.46,52.93 | v30.64,68.29 30.64,61.28 | 30.64,61.28 30.64,56.83 v30.83,56.64 | v19.37,58.42 19.69,58.74 26.67,58.74 29.21,61.28 30.64,61.28 | v29.53,32.39 29.21,32.39 28.58,33.02 v28.58,45.72
AREF_2.5
  Top 0.254: 32.19,54.69 IC4.2 32.17,56.76 31.15,57.79 27.52,57.83 25.83,56.24 25.82,54.88 24.75,53.8 IC2.1
  Top 0.406: R12.2 24.87,46.2 C13.1 24.87,51.19 IC2.1
AREF_-10  (via drill 0.41)
  Top 0.254: v14.29,71.76 15.56,71.76 16.19,71.12 17.78,71.12 18.42,71.76 18.42,73.98 15.56,76.84 15.56,81.28 18.42,84.14 21.27,84.14 21.91,84.77 21.91,85.62 R5.P$3 | R18.P$3 21.38,49.06 R43.2 | 13.33,45.08 13.97,45.72 v14.61,45.72 | R19.P$3 11.38,46.04 12.38,46.04 13.33,45.09 IC7.2 | v22.54,42.55 22.59,42.5 R59.3 | R59.2 R59.3 | R17.P$3 35.24,48.21 35.24,43.18 34.29,42.23 27.31,42.23 27.04,42.5 R59.3 | v9.84,53.66 9.84,49.56 R19.P$3 | R19.P$3 6.19,51.22 R35.2
  Top 0.406: R27.2 C26.1 13.23,44.84 IC7.2 13.33,45.08 | R35.2 3.91,51.12
  Bottom 0.254: v14.61,45.72 14.61,49.53 15.24,50.17 20.96,50.17 21.87,49.25 R18.P$3 22.54,47.89 v22.54,42.55 | v14.29,71.76 13.97,71.44 13.97,69.53 15.24,68.26 15.24,63.18 9.21,57.15 9.21,54.29 v9.84,53.66
ASYM_ADC  (via drill 0.41 pad 0.25)
  Top 0.254: UC1.18 28.01,66.05 26.45,64.48 v26.45,64.33 | v17.46,60.96 IC9.14 17.23,62.02 C29.2 R28.1
  Bottom 0.254: v26.45,64.33 26.45,62.64 24.77,60.96 v17.46,60.96
ATTENUVERTER_ADC
  Top 0.254: R6.P$2 19.37,69.02 19.91,69.56 23.69,69.56 24.38,70.26 25.94,70.26 UC1.12 26.04,70.17
BI  (via drill 0.41)
  Top 0.254: IC4.3 32.82,55.37 v33.66,56.2 | v28.58,20 R13.2
  Bottom 0.254: v28.58,20 28.58,24.77 38.1,34.29 38.1,51.44 33.66,55.88 v33.66,56.2
BI_OUT
  Top 0.254: R23.1 17.67,33.55 R22.2 20.34,30.88 IC5.1
CLOCK  (via drill 0.41)
  Top 0.254: UC1.21 29.09,64.97 28.26,64.14 28.26,59.37 28.58,59.06 v28.58,58.74 | v32.39,33.34 32.39,10.16 31.43,9.21 31.43,7.3 31.12,6.99 Q3.C 29.7,6.82 28.89,7.62 R48.1
  Bottom 0.254: v28.58,58.74 29.46,57.85 29.46,54.93 33.27,51.12 35.56,51.12 36.2,50.48 36.2,35.56 33.97,33.34 v32.39,33.34
CYCLE_SW  (via drill 0.41 pad 0.25)
  Top 0.254: v28.89,67.31 28.89,68.72 UC1.10
  Bottom 0.254: v28.89,67.31 28.89,70.17 28.58,70.49 28.58,71.44 29.31,72.17 29.31,74.71 32.7,77.72 32.77,99.36 SW3.3 SW3.4
DAC_MOSI
  Top 0.254: IC4.7 32.17,58.32 32.7,57.79 34.29,57.79 34.93,58.42 34.93,63.4 UC1.28
DAC_SCK
  Top 0.254: IC4.6 32.82,58.62 33.02,58.42 33.97,58.42 34.29,58.74 34.29,62.62 UC1.26
DAC_SS
  Top 0.254: IC4.5 33.47,62.73 UC1.25
EOA_OUT  (via drill 0.41)
  Top 0.254: v35.56,16.19 37.62,18.26 37.62,30.1 37.02,30.7 37.02,52.83 35.47,54.39 35.44,54.39 35.32,54.5 35.32,57.3 36.14,58.12 36.14,65.72 UC1.33 | v16.83,7.94 16.83,6.57 R57.1
  Bottom 0.254: v35.56,16.19 35.24,15.88 19.69,15.88 16.83,13.02 v16.83,7.94
EOD_OUT  (via drill 0.41)
  Top 0.254: UC1.32 35.66,65.5 35.66,58.29 34.85,57.48 34.85,54.21 34.82,54.18 36.51,52.39 36.51,30.48 37.15,29.85 37.15,19.69 v35.56,18.1 | v2.86,6.99 3.6,6.25 R58.1
  Bottom 0.254: v35.56,18.1 33.97,16.51 19.37,16.51 16.19,13.34 4.45,13.34 2.86,11.75 v2.86,6.99
F_CV
  Top 0.254: R21.1 21.91,31.54 R20.1 20.74,28.89 20,28.89 19.69,29.2 IC5.2 19.69,30.47 19.3,30.86 18.14,30.86 R23.2
FM_ADC
  Top 0.254: IC8.7 6.99,55.14 R34.1 C27.2 8.36,54.29 8.89,54.29 9.21,54.61 9.21,56.2 10.48,57.47 10.8,57.47 11.11,57.79 11.11,60.96 10.48,61.6 10.48,62.55 10.16,62.87 10.16,66.96 10.95,67.75 14.8,67.75 15.56,66.99 26.15,66.99 UC1.14
FREEZE  (via drill 0.41)
  Top 0.254: UC1.19 27.62,64.93 27.62,59.06 v25.89,57.43 | v23.84,52.84 24.04,52.8 24.04,50.39 23.94,50.29 23.94,46.48 v23.5,46.04 | Q4.C 26.82,6.82 27.31,7.3 R49.1 26.57,9.63 26.04,10.16 26.04,12.07 29.53,15.56 29.53,30.16 26.67,33.02 v23.5,33.02
  Bottom 0.254: v25.89,57.43 25.89,54.87 v23.84,52.84 | v23.5,46.04 v23.5,33.02
GND  (via drill 0.41)
  Top 0.254: 33.97,75.78 C4.2 34.16,75.54 34.16,75.03 32.63,73.49 UC1.47 32.63,73.46 31.5,72.33 31.5,69.41 | 30.54,65.66 30.54,65.02 UC1.23 29.31,63.79 29.31,62.71 C14.2 | 30.54,65.66 30.16,66.04 29.44,66.04 UC1.20 | 32.89,68.01 35.27,68.01 UC1.35 | 32.89,68.01 30.54,65.66 | 37.2,95.83 JTAG.9 37.84,95.83 38.1,95.57 38.1,93.66 37.78,93.35 37.24,93.35 JTAG.5 | 31.5,69.41 32.89,68.01 | IC9.5 20,57.79 20.32,58.1 20.32,59.06 20,59.37 18.73,59.37 | IC9.10 IC9.11 IC9.12 18.73,59.37 | C30.2 6.23,60.13 5.72,60.64 IC8.3 IC8.4 IC8.5 | Q2.E 37.15,4.44 | 32.07,4.13 Q3.E 32.07,4.44 | 26.99,4.13 Q4.E 26.99,4.44 | 20.64,4.13 Q5.E | Q5.E 20.64,4.44 | R50.1 15.56,4.13 | R52.1 8,4.55 Q6.E | R26.1 9.84,12.7 | 11.77,26.31 C23.2 13.28,26.28 13.02,23.5 12.07,22.54 C25.1 10.38,20.22 7.94,17.78 | J9.P2 | IC5.3 19.04,28.8 | 19.04,28.8 19.79,28.05 | 19.79,28.05 C18.2 | C15.2 C16.2 | 18.73,59.37 18.42,59.06 18.42,58.1 18.73,57.79 IC9.3 18.73,56.2 18.42,55.88 17.88,55.88 C33.2 16.57,54.83 15.59,53.76 14.86,53.76 13.65,52.64 13.65,52.01 12.32,50.67 12.32,49.85 13.27,48.9 16.54,48.9 R18.P$1 | 7.94,17.78 6.67,16.51 6.67,14.29 5.08,12.7 J13.P1 | v21.27,71.44 21.53,71.18 C11.2 C12.2 22.65,73.13 23.29,73.52 25.48,73.52 UC1.8 28.83,70.2 29.62,69.41 31.5,69.41 | v19.05,27.31 19.79,28.05 | 19.04,28.8 18.95,28.89 17.46,28.89 16.93,28.36 C24.1 | Q5.E 20.64,9.84 20.96,10.16 v20.96,12.07 | C20.2 7.94,17.88 7.94,17.78
  Top 0.406: C14.2 29.79,61.2 IC4.8 | J9.P1 J9.P2 v10.48,35.56 | 11.77,26.31 10.4,27.68 J9.P2 | C24.1 C22.2 v15.56,27.05 | JP2.4 JP2.3 JP2.5 JP2.7 | JP2.8 JP2.6 JP2.4 | 8.77,80.98 C1.- | C1.- 10.7,80.91 | 5.74,74.09 IC1.1 3.53,73.38 v3.49,73.34 | JP2.4 5.06,93.17 | C26.2 11.53,44.84 IC7.1 9.84,43.35 v9.84,42.86 6.35,46.36 J3.P1 3.85,47.59 R19.P$1 | 28.58,75.57 C7.2 28.84,76.14 v30.16,77.47 32.7,77.47 33.97,76.2 33.97,75.78 | C9.- 10.64,84.47 C1.- | v19.53,63.88 19.37,63.72 IC9.11 | 29.85,44.45 31.75,44.45 J1.P1 | 29.85,44.45 21.27,44.45 J2.P1 14.92,41.91 14.92,41.28 v13.65,40.01 | C15.2 33.02,50.87 33.02,50.48 32.7,50.17 30.48,50.17 29.89,49.57 R17.P$1 29.85,48.52 29.85,44.45 | IC2.2 26.57,51.19 C13.2 26.04,49 v26.04,47.94 | C30.2 9.53,60.72 v9.53,62.23 | v20.96,12.07 J12.P1 14.29,11.75 10.8,11.75 9.84,12.7 | JTAG.9 37.18,98.39 35.56,100.01 35.56,103.47 SW3.2 SW3.1 30.44,105.13 29.85,105.73 26.99,105.73 | 26.99,105.73 19.37,105.73 | 19.37,105.73 11.75,105.73 | 11.75,105.73 8.61,105.73 SW4.2 SW4.1 | LED3.2 11.75,105.73 | LED2.2 19.37,105.73 | LED1.2 26.99,105.73 | JTAG.5 JTAG.3 | 37.15,4.44 37.15,3.93 36.54,3.33 32.07,3.33 | 32.07,3.33 26.99,3.33 | 26.99,3.33 20.64,3.33 | 20.64,3.33 15.56,3.33 | 15.56,3.33 10,3.33 9.53,3.81 R52.1 | 15.56,4.13 15.56,3.33 | Q5.E 20.64,3.33 | 26.99,4.13 26.99,3.33 | 32.07,4.13 32.07,3.33
  Bottom 0.406: J13.P1 J12.P1 | 1.51,103.58 SW4.1 | v15.56,27.05 15.18,27.05 J9.P1 | v20.96,12.07 J11.P1 J10.P1 J5.P2 | J4.P2 J4.P1 20.96,29.21 v19.05,27.31 | v30.16,77.47 30.16,79.38 28.26,81.28 | v10.48,35.56 9.84,36.2 v9.84,42.86 10.8,42.86 v13.65,40.01 | v3.49,73.34 5.72,71.12 5.72,66.04 v9.53,62.23 | v21.27,71.44 21.87,70.84 R6.P$3 19.53,65.94 v19.53,63.88 | v26.04,47.94 26.66,48.56 R17.P$1 | R18.P$1 16.87,47.59 18.1,46.36 J2.P1
  other vias: 27.36,94.14 34.97,97.94 22.63,88.55 14.56,86.84 12.72,94.35 3.45,96.95 4.24,102.89 33.99,102.87 21.5,40.64 32.24,39.95
  pour Bottom: 38.73,0 0,0 0,106.8 38.73,106.8
  pour Top: 38.73,0 0,0 0,106.8 38.73,106.8
JTCK  (via drill 0.41 pad 0.25)
  Top 0.254: UC1.37 37.06,69.94 v37.47,69.53 | v33.91,92.02 35.86,92.08 JTAG.4
  Bottom 0.254: v37.47,69.53 37.47,70.17 36.7,70.93 36.7,72.1 37.27,72.68 37.27,84.96 33.92,88.37 v33.91,92.02
JTDI  (via drill 0.41 pad 0.25)
  Top 0.254: UC1.38 36.77,71.25 v37.66,71.25
  Bottom 0.254: v37.66,71.25 37.66,72.26 37.78,72.39 37.78,85.15 35.24,87.69 35.24,89.85 34.61,90.49 34.61,93.98 35.24,94.62 35.86,94.62 JTAG.8
JTDO
  Top 0.254: UC1.39 38.07,73.25 38.07,87.98 36.51,89.54 35.16,89.54 33.01,91.73 33,92.44 33.93,93.37 35.86,93.35 JTAG.6
JTMS  (via drill 0.41 pad 0.25)
  Top 0.254: UC1.34 35.46,67.1 36.2,66.36 v36.83,66.36 | v35.24,85.41 35.24,87.31 36.13,88.2 v36.13,88.27
  Bottom 0.254: v36.83,66.36 36.83,68.58 36.2,69.22 36.2,73.03 36.74,73.56 36.74,83.92 v35.24,85.41 | v36.13,88.27 36.13,90.53 JTAG.2
LEVEL_ADC
  Top 0.254: UC1.16 | C34.2 24.77,58.32 24.77,57.79 24.45,57.47 23.5,57.47 22.84,56.81 IC9.7 21.27,55.56 21.91,54.93 R45.1 | C34.2 24.77,58.42 | C34.2 25.53,59.28 25.53,61.44 25.88,61.79 25.88,62.74 24.8,63.82 24.8,65.12 25.46,65.79 26.35,65.79 UC1.16
N$1  (via drill 0.41)
  Top 0.254: R42.2 15.98,46.67 v16.19,46.67 | v21.59,38.42 31.43,38.42 J1.P3
  Bottom 0.254: v16.19,46.67 16.51,46.36 16.51,41.91 20,38.42 v21.59,38.42
N$2  (via drill 0.41)
  Top 0.254: 17.15,58.42 C32.1 R40.2 | 17.15,58.42 18.1,57.47 IC9.2 | v17.15,59.37 17.15,58.42 | v13.24,50.29 13.79,49.75 R42.1 14.82,49.75 15.24,50.17 16.3,50.17 R41.1
  Bottom 0.254: v17.15,59.37 18.1,58.42 18.1,53.91 14.48,50.29 v13.24,50.29
N$3  (via drill 0.41)
  Top 0.254: R41.2 19.27,51.44 v19.69,51.44
  Bottom 0.254: R17.P$2 32.39,49.53 30.48,51.44 v19.69,51.44
N$4  (via drill 0.41)
  Top 0.254: 18.04,65.56 R29.2 17.95,65.62 17.62,65.94 14.48,65.94 v14.22,66.2
  Bottom 0.254: v14.22,66.2 14.22,63.12 11.11,60.01 8.26,60.01 7.62,59.37 7.62,53.34 10.8,50.17 10.8,44.77 J2.P3
N$5
  Top 0.254: IC9.13 R29.1 17.89,63.92 17.69,63.72 C29.1 R28.2 R30.1
N$6  (via drill 0.41)
  Top 0.254: R46.1 17.72,52.3 v17.72,51.85 | v27.31,53.02 27.75,52.58 v27.75,50.55 | J7.P2 17.46,14.61 21.91,19.05 21.91,20.96 22.23,21.27 23.18,21.27 23.5,20.96 24.77,20.96 25.4,21.59 25.4,22.86 24.45,23.81 v24.45,31.75
  Bottom 0.254: v27.31,53.02 26.35,52.07 22.54,52.07 22.23,52.39 18.26,52.39 v17.72,51.85 | v24.45,31.75 24.45,49.21 25.78,50.55 v27.75,50.55
N$7
  Top 0.254: UC1.5 27.94,73.22 27.43,73.22 26.67,73.98 26.67,76.3 21.25,81.72 20.93,81.72 X1.P$2
  Top 0.61: X1.P$2 18.96,81.52 C2.2
N$8  (1 unrouted)
  Top 0.254: UC1.6 27.74,72.71 27.24,72.71 26.04,73.91 26.04,75.98 24.77,77.25 20.99,77.25 X1.P$1
  Top 0.61: C17.2 21.61,76.81 20.96,77.47
N$9
  Top 0.254: R30.2 11.75,61.7 11.75,57.3 12.86,56.2 12.86,54.93 11.24,53.32 11.24,49.72 14.29,46.67 14.92,46.67 15.88,45.72 16.83,45.72 19.37,48.26 R18.P$2
N$10  (via drill 0.41)
  Top 0.254: R32.2 22.96,64.77 13.34,64.77 13.02,65.09 v12.38,65.09
  Bottom 0.254: v12.38,65.09 12.38,62.23 10.8,60.64 7.94,60.64 6.99,59.69 6.99,53.02 10.16,49.85 10.16,45.4 5.08,40.32 J3.P3
N$11
  Top 0.254: IC9.9 20.64,63.6 R31.1 R32.1 23.81,63.24 C28.1 R33.2
N$12  (via drill 0.41)
  Top 0.254: R31.2 20.09,66.48 15.37,66.48 14.61,67.25 11.68,67.25 11.11,66.68 v11.11,65.56
  Bottom 0.254: v11.11,65.56 11.11,61.91 10.48,61.28 7.62,61.28 6.35,60.01 R19.P$2
N$13  (via drill 0.41)
  Top 0.254: v21.27,46.67 22.54,46.67 23.18,47.31 23.18,49.85 22.86,50.17 22.23,50.17 22.23,52.07 21.27,52.07 20.54,52.81 20.19,52.81 R44.2 | v19.05,40.96 v13.34,35.24
  Bottom 0.254: v21.27,46.67 21.27,43.18 v19.05,40.96 | v13.34,35.24 5.08,26.99 J8.P3
N$14
  Top 0.254: C34.1 21.59,58.42 20.64,57.47 IC9.6 20.64,55.56 20.19,55.12 R44.1 R45.2 23.08,51.96 R43.1
N$15  (via drill 0.41)
  Top 0.254: J6.P3 23.5,22.86 23.5,30.48 22.54,31.43 v22.54,35.88 | v17.15,72.07 15.48,73.54 10.72,73.54 7.08,69.95 4.41,69.95 3.49,70.87 v3.49,71.12 | v2.38,68.58 2.54,68.42 R39.2 | v13.14,54.01 13.14,52.93 v12.22,52.01
  Bottom 0.254: v22.54,35.88 20.96,37.47 19.37,37.47 11.75,45.09 11.75,51.75 11.97,51.75 v12.22,52.01 | v3.49,71.12 2.38,70.01 v2.38,68.58 | v13.14,54.01 13.14,54.17 12.89,54.7 12.89,57.88 17.15,62.23 20.64,62.23 23.5,65.09 23.5,71.12 22.23,72.39 17.46,72.39 v17.15,72.07
N$16
  Top 0.254: IC8.2 6.99,64.24 R37.2 | R37.2 R38.1 R39.1 | C31.1 R37.2
N$17  (via drill 0.41)
  Top 0.254: 4.45,66.36 R38.2 4.45,66.68 5.08,67.31 7.3,67.31 v7.62,67.63
  Bottom 0.254: R5.P$2 7.62,73.92 v7.62,67.63
N$18  (via drill 0.41)
  Top 0.254: R22.1 18.84,33.55 v15.88,36.51 | v5.72,29.21 v2.86,26.35
  Bottom 0.254: v15.88,36.51 13.02,36.51 v5.72,29.21 | J13.P3 1.27,5.72 1.27,24.77 v2.86,26.35
N$19
  Top 0.254: R5.P$1 16.87,84.6 R8.2
N$20  (via drill 0.41)
  Top 0.254: R36.2 3.49,45.82 v3.49,42.64
  Bottom 0.254: v3.49,42.64 3.81,42.32 3.81,40.32 2.86,39.37 2.86,31.43 4.45,29.85 4.45,23.81 3.49,22.86 3.49,21.59 4.45,20.64 6.99,20.64 8.57,22.23 J7.P3
N$21  (via drill 0.41)
  Top 0.254: 22.96,6.25 R56.1 22.86,6.57 v22.86,17.46
  Bottom 0.254: J5.P3 28.89,17.46 v22.86,17.46
N$22
  Top 0.254: IC8.6 5.72,56.1 | R34.2 C27.1 | 5.72,55.88 3.81,53.98 R35.1 | 3.74,52.92 1.59,50.77 R36.1
  Top 0.406: 5.72,55.88 5.72,56.1 | R34.2 5.6,52.92 R35.1 3.74,52.92
N$23
  Top 0.254: Q4.B 23.25,4.62 R56.2
N$24  (via drill 0.41)
  Top 0.254: R54.1 28.04,5.72 24.45,5.72 24.13,5.4 22.23,5.4 v21.59,6.03
  Bottom 0.254: v21.59,6.03 16.19,0.64 3.81,0.64 0.64,3.81 0.64,26.99 J9.P3
N$25
  Top 0.254: Q3.B 28.64,4.62 R54.2
N$26
  Top 0.254: Q6.B 4.51,4.62 R58.2
N$27
  Top 0.254: J11.P3 22.86,0.64 9.53,0.64 6.99,3.18 Q6.C 7.55,6.25 R52.2 R53.1
N$28
  Top 0.254: LED3.3 10.48,103.95 R10.2
N$29
  Top 0.254: LED3.1 13.65,104.59 R9.2
N$30
  Top 0.254: LED2.3 17.37,102.23 R7.2
N$31
  Top 0.254: R4.2 21.27,104.59 LED2.1
N$32
  Top 0.254: R3.2 25.08,104.59 LED1.3
N$33
  Top 0.254: R2.2 28.26,103.95 LED1.1
N$34  (via drill 0.41)
  Top 0.254: UC1.46 32.99,73.12 34.48,74.61 34.8,74.61 35.08,74.9 35.08,78.99 33.7,78.99 v31.04,81.66 | 10.58,100.33 R10.1 10.52,100.47 11.57,100.47 15.5,96.54 27.15,96.54 28.19,95.5 v28.25,95.5
  Bottom 0.254: v31.04,81.66 31.04,92.72 v28.25,95.5
N$35  (via drill 0.41)
  Top 0.254: UC1.45 34.48,73.91 34.86,73.91 35.56,74.61 35.56,79.22 32.39,82.39 32.37,82.39 v31.97,82.79 | v28.28,97.02 18.41,97.02 14.99,100.44 R9.1
  Bottom 0.254: v31.97,82.79 31.97,93.61 v28.28,97.02
N$36
  Top 0.254: UC1.43 34.04,72.08 36.1,74.14 36.1,79.34 32.86,82.58 32.86,89.14 30.7,91.3 30.7,95.73 28.59,97.85 19.05,97.85 17.42,99.48 17.42,100.39 R7.1
N$37
  Top 0.254: UC1.42 36.61,73.91 36.61,79.5 33.34,82.77 33.34,89.3 31.14,91.5 31.14,95.91 28.75,98.3 23.4,98.3 R4.1 21.38,100.33 21.88,100.33
N$38
  Top 0.254: UC1.41 37.12,73.72 37.12,79.66 33.81,82.96 33.81,89.44 31.76,91.49 31.76,95.95 28.92,98.79 26.73,98.79 R3.1
N$39
  Top 0.254: UC1.40 35.12,71 37.59,73.47 37.59,79.88 34.29,83.19 34.29,89.7 32.4,91.59 32.4,96.29 R2.1 | 28.36,100.33 R2.1 | 28.47,100.65 R2.1
N$40
  Top 0.254: R59.1 26.39,37.47 22.54,37.47 21.59,36.51 R21.2
N$41
  Top 0.254: IC6.2 9.2,15.15 R26.2 9.32,14.5 R25.2
N$42
  Top 0.254: IC5.6 IC5.7 19.69,22.77 C19.2 20.11,23.18 22.54,23.18 22.86,23.5 22.86,27.31 21.91,28.26 R20.2
N$43
  Top 0.254: IC5.5 17.02,24.27 C22.1 16.83,22.76 R15.1
N$44  (via drill 0.41)
  Top 0.254: R50.2 15.56,8.26 16.51,9.21 19.37,9.21 v19.69,8.89
  Top 0.406: v19.69,8.89 Q5.C | R50.2 R51.1
  Bottom 0.254: J10.P3 27.94,1.91 20.96,8.89 v19.69,8.89
N$45
  Top 0.254: R13.1 20.32,20.74 C19.1 R15.2
N$46
  Top 0.254: IC6.1 8.55,15.43 R25.1 6.35,13.23 6.35,12.07 7.41,11.01 R24.2
N$47
  Top 0.254: Q5.B 17.21,4.62 R57.2
N$48
  Top 0.254: R60.2 4.45,15.24 J8.P2
N$49  (via drill 0.41)
  Top 0.61: G1.~1 10.5,98.43 v12.07,98.43
  Bottom 0.61: v12.07,98.43 3.18,98.43 1.91,97.16 1.91,95.41 JP2.1 JP2.2
N$50  (via drill 0.41)
  Top 0.61: v7.62,96.52 7.62,98.27 G1.~2
  Bottom 0.61: JP2.9 JP2.10 6.35,85.09 6.99,85.73 6.99,95.89 v7.62,96.52
N$57
  Top 0.254: R55.1 33.76,6.35 34.61,6.35 34.93,6.67 34.93,15.24 34.61,15.56 34.61,20.96 35.88,22.23 J4.P3
N$66
  Top 0.254: Q2.B 33.72,4.62 R55.2
N$67  (via drill 0.41 pad 0.25)
  Top 0.254: C21.2 11.96,12.7 11.43,12.7 11.11,13.02 11.11,14.92 10.48,15.56 10.16,15.56 9.85,15.87 IC6.3 v9.84,17.78 | IC6.7 IC6.6 v9.85,20.96 v9.84,20.96
  Bottom 0.254: v9.84,20.96 v9.84,17.78
N$69
  Top 0.254: IC6.5 10.48,22.27 10.48,23.5 9.84,24.13 R16.1 C23.1
N$71  (via drill 0.41)
  Top 0.254: R16.2 9.32,25.93 R14.1 3.6,24.23 v2.54,23.18 | v12.07,16.19 C21.1
  Bottom 0.254: v2.54,23.18 2.54,19.69 6.03,16.19 v12.07,16.19
PROC_ADC  (via drill 0.41 pad 0.25)
  Top 0.254: UC1.17 26.58,65.31 25.72,65.31 25.34,64.93 25.34,64.01 26.35,62.99 26.35,60.33 26.51,60.17 v26.51,60.01 | IC9.8 21.41,62.39 C28.2 R33.1 22.81,60.01 v21.27,60.01
  Bottom 0.254: v26.51,60.01 v21.27,60.01
RANGE_SW  (via drill 0.41 pad 0.25)
  Top 0.254: UC1.11 27.94,68.97 v27.94,68.26 | SW4.4 SW4.3
  Bottom 0.254: v27.94,68.26 27.94,71.76 28.73,72.55 28.73,77.31 27.31,78.74 27.31,92.08 18.73,100.65 8.05,100.65 SW4.4
RESET  (via drill 0.41 pad 0.25)
  Top 0.254: v29.53,70.8 28.94,70.8 UC1.7
  Bottom 0.254: v29.53,70.8 29.85,71.12 29.85,74.3 33.19,77.4 33.24,93.12 35.51,95.83 JTAG.10
SHAPE_ADC  (via drill 0.41)
  Top 0.254: 26.97,67.1 UC1.15 26.34,66.48 22.67,66.48 22.35,66.17 v22.35,65.98 | IC9.1 16.21,56.81 15.56,57.47 14.29,57.47 13.97,57.79 13.97,58.32 C32.2 R40.1 | 13.97,60.43 R40.1 | R40.1 13.12,59.37 v12.7,59.37
  Bottom 0.254: v12.7,59.37 16.19,62.87 20.32,62.87 22.35,64.9 v22.35,65.98
START  (via drill 0.41)
  Top 0.254: UC1.22 28.77,63.94 28.8,63.91 28.8,60.64 v29.37,60.07 | v31.12,32.07 31.12,12.7 31.43,12.38 31.43,10.48 30.58,9.63 R47.1 | 30.9,9.63 R47.1 | Q2.C v36.2,8.32 | v30.48,8.32 R47.1
  Bottom 0.254: v31.12,32.07 33.66,32.07 36.83,35.24 36.83,50.8 35.88,51.75 33.37,51.75 29.94,55.18 29.94,59.5 v29.37,60.07 | v36.2,8.32 36.2,8.26 35.88,7.94 30.86,7.94 v30.48,8.32
UNI  (via drill 0.41)
  Top 0.254: v7.62,27.31 R14.2 | v34.93,52.71 34.61,53.02 34.61,53.34 33.47,54.48 IC4.4
  Bottom 0.254: v7.62,27.31 7.62,28.58 9.84,30.8 33.66,30.8 37.47,34.61 37.47,51.12 35.88,52.71 v34.93,52.71
UNI_OUT  (via drill 0.41)
  Top 0.254: v13.34,7.62 10.16,10.8 R24.1
  Bottom 0.254: J12.P3 14.61,6.35 v13.34,7.62
VCC  (via drill 0.41)
  Top 0.254: IC6.8 8.55,22.1 | R60.1 3.49,19.37
  Top 0.406: R51.2 12.38,4.55 | 12.38,4.55 R53.2 | 3.49,19.37 3.18,19.05 3.18,8.89 4.13,7.94 6.03,7.94 6.35,8.26 11.43,8.26 12.38,7.3 12.38,4.55 | IC1.3 5.65,68.9 3.81,68.9 | v2.54,44.13 2.22,44.13 1.27,43.18 1.27,21.59 3.5,19.37 R60.1 4.45,19.69 5.08,20.32 6.77,20.32 C20.1 v6.99,22.54 8.11,22.54 8.55,22.1 | v3.81,67.95 3.81,68.9 | 3.81,68.9 2.22,70.49 2.22,77.47 3.25,78.5 5.66,78.5 7.9,80.74 | v20,25.72 20.34,25.38 IC5.8 20.38,24.23 C18.1 | C8.+ 29.7,84.55 IC3.3
  Top 0.61: 7.9,80.74 G1.+ 7.78,92.56 7.78,94.35 9.22,95.78 13.56,95.82 13.62,95.82 14.29,95.15 19.31,95.15 19.41,95.05 19.41,94.25 C3.+ 19.34,93.73 25.29,87.79 29.39,87.79 30.03,87.14 30.03,84.88 IC3.3
  Bottom 0.406: v3.81,67.95 4.45,67.31 4.45,52.07 2.22,49.85 2.22,44.77 2.54,44.45 v2.54,44.13 | v20,25.72 10.16,25.72 v6.99,22.54
VEE  (via drill 0.41)
  Top 0.254: 16.87,30.02 C24.2
  Top 0.406: IC5.4 16.87,30.02 | C10.- 1.27,78.28 1.27,62.23 2.22,61.28 v2.22,59.69 | R27.1 11.75,41.38 11.75,35.14 C24.2 14.29,27.52 14.29,23.81 13.02,22.54 13.02,19.47 C25.2 12.07,18.06 IC6.4 | R27.1 11.22,41.28 | v2.54,41.59 R27.1
  Top 0.61: G1.- 10.5,93.69 v10.8,93.98 | v5.72,81.28 4.27,81.28 C10.-
  Bottom 0.406: v2.22,59.69 3.49,58.42 3.49,52.39 1.27,50.17 1.27,42.86 v2.54,41.59
  Bottom 0.61: v10.8,93.98 10.8,92.71 8.26,90.17 8.26,83.82 v5.72,81.28
VOCT_ADC  (via drill 0.41, 0.41 pad 0.25)
  Top 0.254: UC1.13 26.26,68.35 v25.72,68.9 | R37.1 C31.2 | IC8.1 8.26,63.18 8.89,63.18 9.53,63.82 9.53,65.72 8.99,66.26 C31.2 | C31.2 8.79,66.26 11.11,68.58 13.34,68.58 v15.24,70.49
  Bottom 0.254: v15.24,70.49 15.24,72.07 16.19,73.03 22.54,73.03 25.72,69.85 v25.72,68.9

### Text on the board
tNames: RESET | JTDI | JTDO | JTCK | JTMS | Either Way | Original "Tides" design Olivier Gillet cc-by-sa | PCB design Electric Mist 2017 Swirls/Lamb V1.1